# Altium schematic sheet TELM0005_TempSenseHIGH_BCR.SchDoc: Temperature Sensor Circuit
size A3; Engineer: A. SHAW; Organization: BLUEsat Project; Address1: Room 419; Address2: School of EE&T; Address3: UNSW, NSW 2052; Address4: Australia; DocumentNumber: TELM0003; SheetNumber: 1; SheetTotal: 1; Version: 1.0
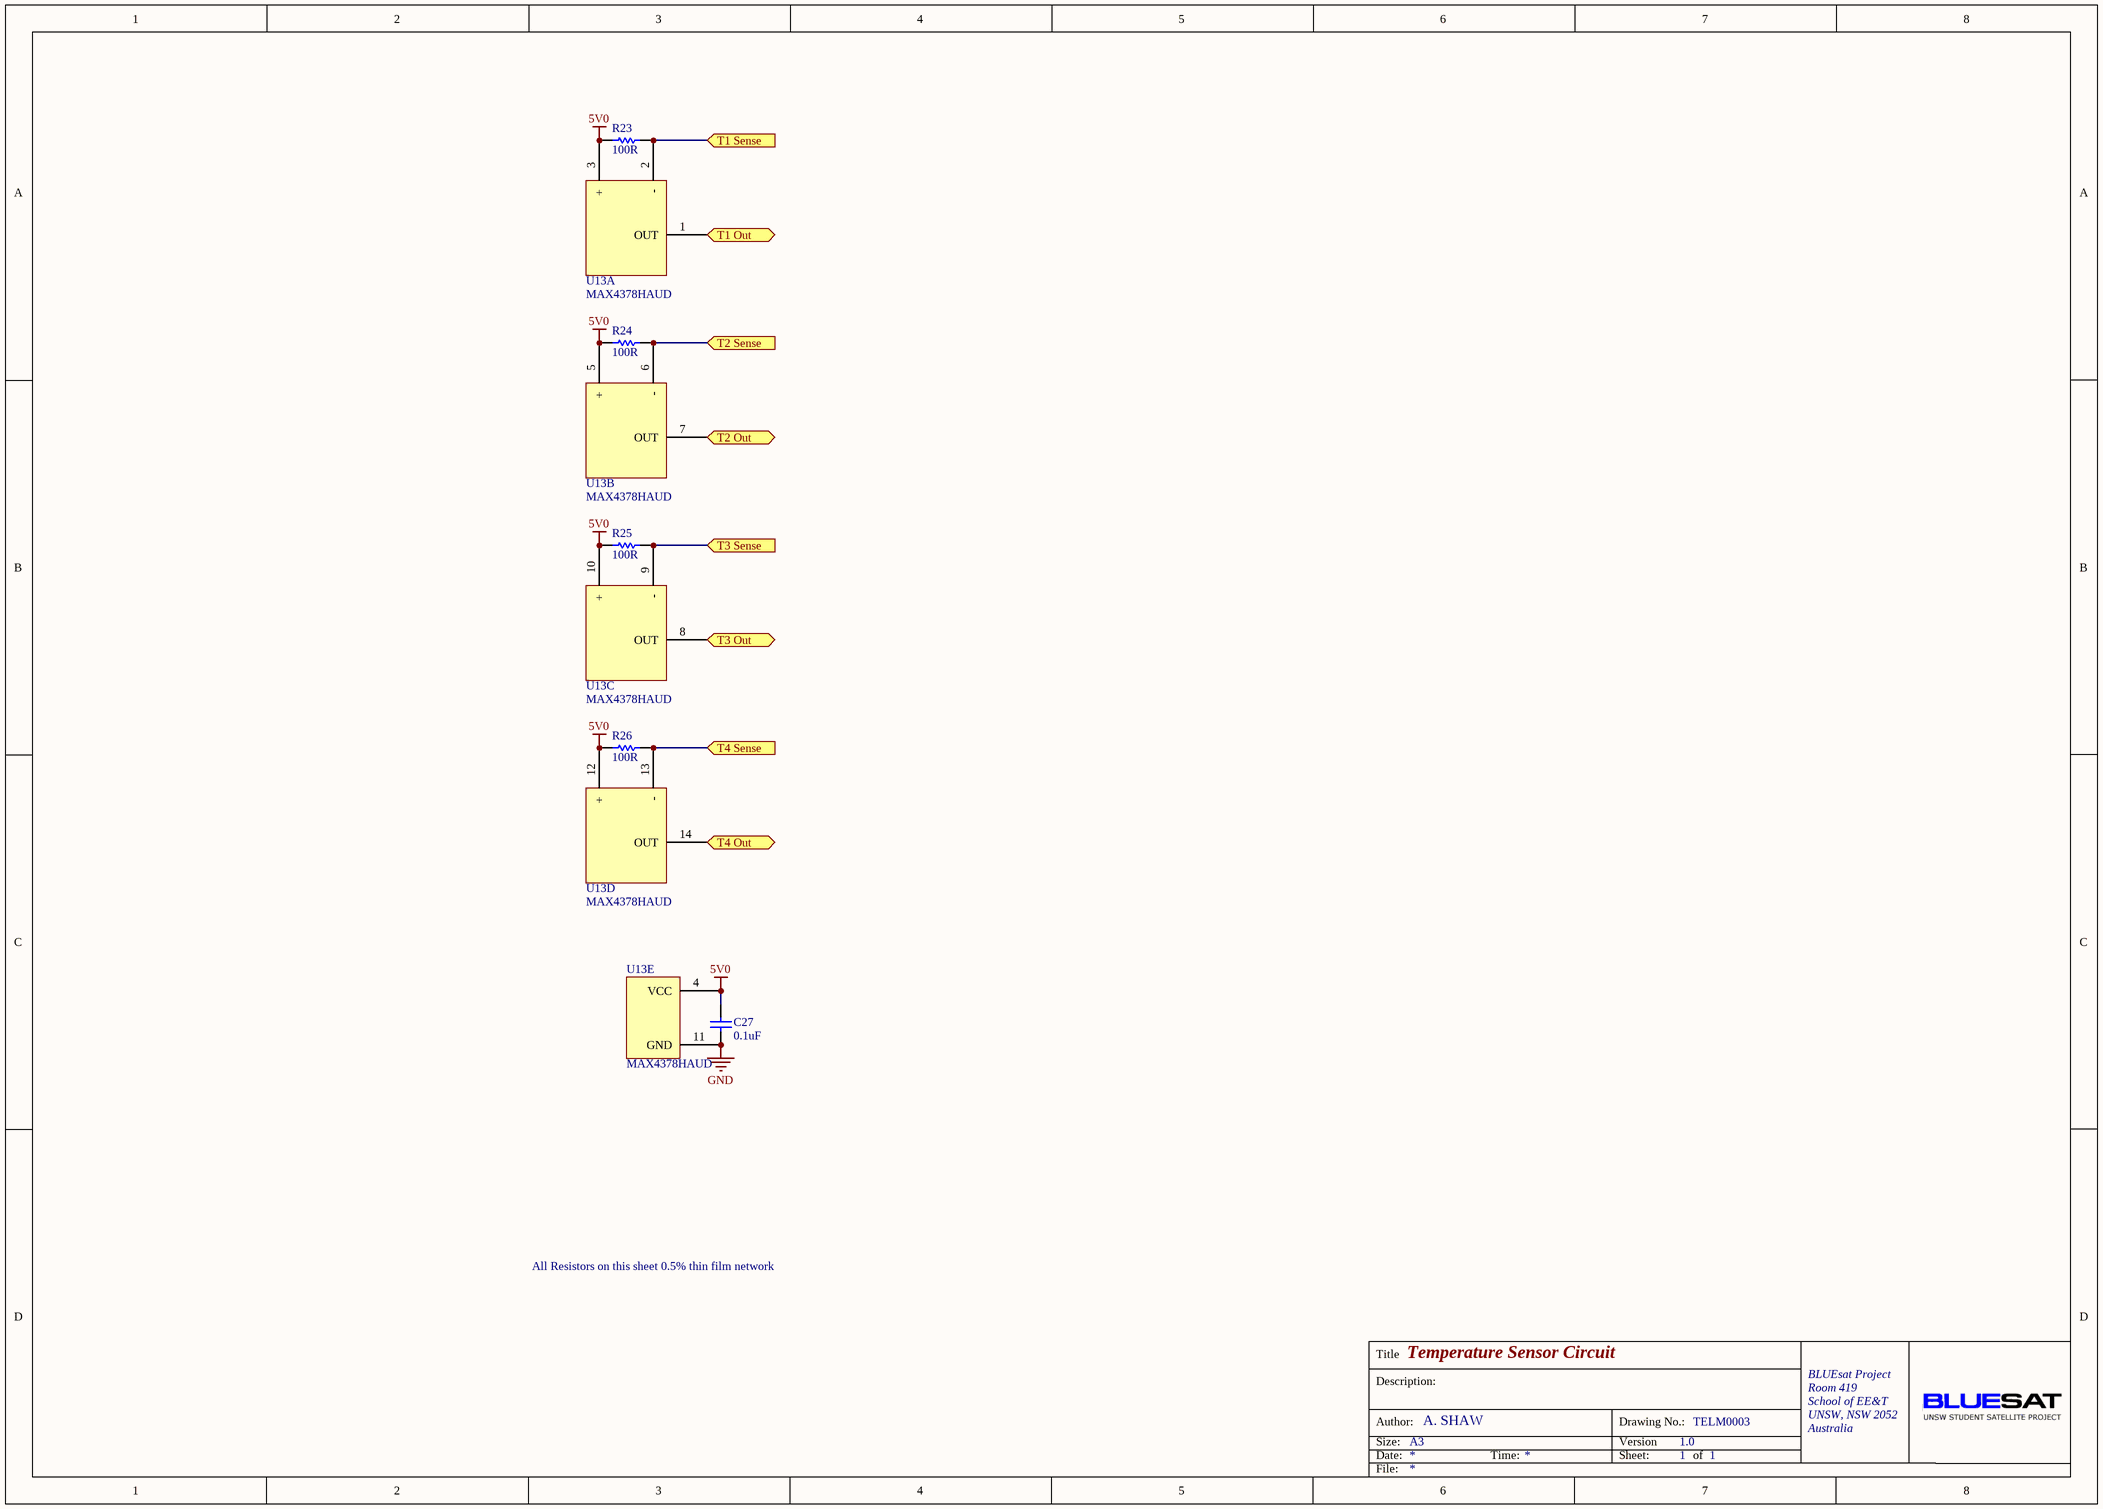
[diagram p0: TELM0005_TempSenseHIGH_BCR.SchDoc]

## Parts
C27  value 0.1uF  [CAPC2012M]  (hidden comment: Cap)
R23  value 100R  [RESC2012M]  (hidden comment: Res1)
R24  value 100R  [RESC2012M]  (hidden comment: Res1)
R25  value 100R  [RESC2012M]  (hidden comment: Res1)
R26  value 100R  [RESC2012M]  (hidden comment: Res1)
U13  MAX4378HAUD  [TSOP65P640-14AN]  (parts A,B,C,D,E of 5)

## Ports
T1 Out (out), T1 Sense (in), T2 Out (out), T2 Sense (in), T3 Out (out), T3 Sense (in), T4 Out (out), T4 Sense (in)

## Nets
5V0: C27.2 R23.1 R24.1 R25.1 R26.1 U13.3(+) U13.4(VCC) U13.5(+) U13.10(+) U13.12(+)
GND: C27.1 U13.11(GND)
T1 Out: U13.1(OUT) ; port T1 Out
T1 Sense: R23.2 U13.2(-) ; port T1 Sense
T2 Out: U13.7(OUT) ; port T2 Out
T2 Sense: R24.2 U13.6(-) ; port T2 Sense
T3 Out: U13.8(OUT) ; port T3 Out
T3 Sense: R25.2 U13.9(-) ; port T3 Sense
T4 Out: U13.14(OUT) ; port T4 Out
T4 Sense: R26.2 U13.13(-) ; port T4 Sense

## Notes on the sheet
- All Resistors on this sheet 0.5% thin film network
- Title
- Description:
- Size:
- Author:
- Date:
- A3
- Time:
- Version
- Sheet:
- Drawing No.:
- of
- File:

## Library data of the parts
C27 = Cap: Capacitor; Published: 8-Jun-2000; LatestRevisionDate: 17-Jul-2002; LatestRevisionNote: Re-released for DXP Platform.; PackageReference: RAD-0.3; Publisher: Altium Limited; PackageDescription: Radial Cap, Thru-Hole; 2 Leads; 0.3 in Pin Spacing; Supplier 1: Farnell; Supplier 2: Farnell; Supplier Part Number 2: 1759265
R23-R26 = Res1: Resistor; Published: 8-Jun-2000; LatestRevisionDate: 17-Jul-2002; LatestRevisionNote: Re-released for DXP Platform.; PackageReference: AXIAL-0.3; Publisher: Altium Limited; PackageDescription: Axial Device, Thru-Hole; 2 Leads; 0.3 in Pin Spacing; Supplier 1: Farnell